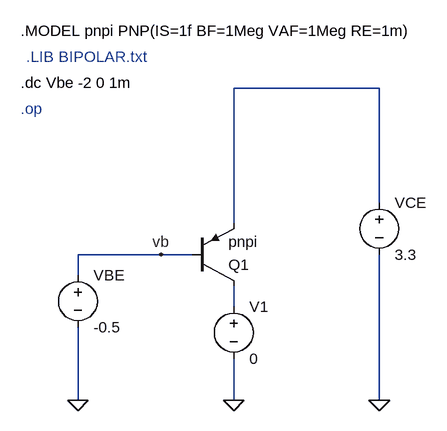
[diagram p0: schematic Draft1.asc]
Draft1.asc, the LTspice schematic file:
Version 4
SHEET 1 880 680
WIRE 464 -96 240 -96
WIRE 464 80 464 -96
WIRE 240 112 240 -96
WIRE 128 160 0 160
WIRE 176 160 128 160
WIRE 0 192 0 160
WIRE 240 240 240 208
WIRE 0 384 0 272
WIRE 240 384 240 320
WIRE 464 384 464 160
FLAG 0 384 0
FLAG 464 384 0
FLAG 240 384 0
FLAG 128 160 vb
SYMBOL pnp 176 208 M180
SYMATTR InstName Q1
SYMATTR Value pnpi
SYMBOL voltage 240 224 R0
SYMATTR InstName V1
SYMATTR Value 0
SYMBOL voltage 0 176 R0
WINDOW 123 0 0 Left 0
WINDOW 39 0 0 Left 0
SYMATTR InstName VBE
SYMATTR Value -0.5
SYMBOL voltage 464 64 R0
SYMATTR InstName VCE
SYMATTR Value 3.3
TEXT -88 -184 Left 2 !.MODEL pnpi PNP(IS=1f BF=1Meg VAF=1Meg RE=1m)
TEXT -80 -144 Left 2 ;.LIB BIPOLAR.txt
TEXT -88 -104 Left 2 !.dc Vbe -2 0 1m
TEXT -88 -64 Left 2 ;.op

The netlist it stands for:
* Draft1.asc
Q1 N002 vb N001 0 pnpi
V1 N002 0 0
VBE vb 0 -0.5
VCE N001 0 3.3
.model NPN NPN
.model PNP PNP
.lib standard.bjt
.MODEL pnpi PNP(IS=1f BF=1Meg VAF=1Meg RE=1m)
* .LIB BIPOLAR.txt
.dc Vbe -2 0 1m
* .op
.backanno
.end